# Altium schematic sheet Sheet1-nano.SchDoc
size A4
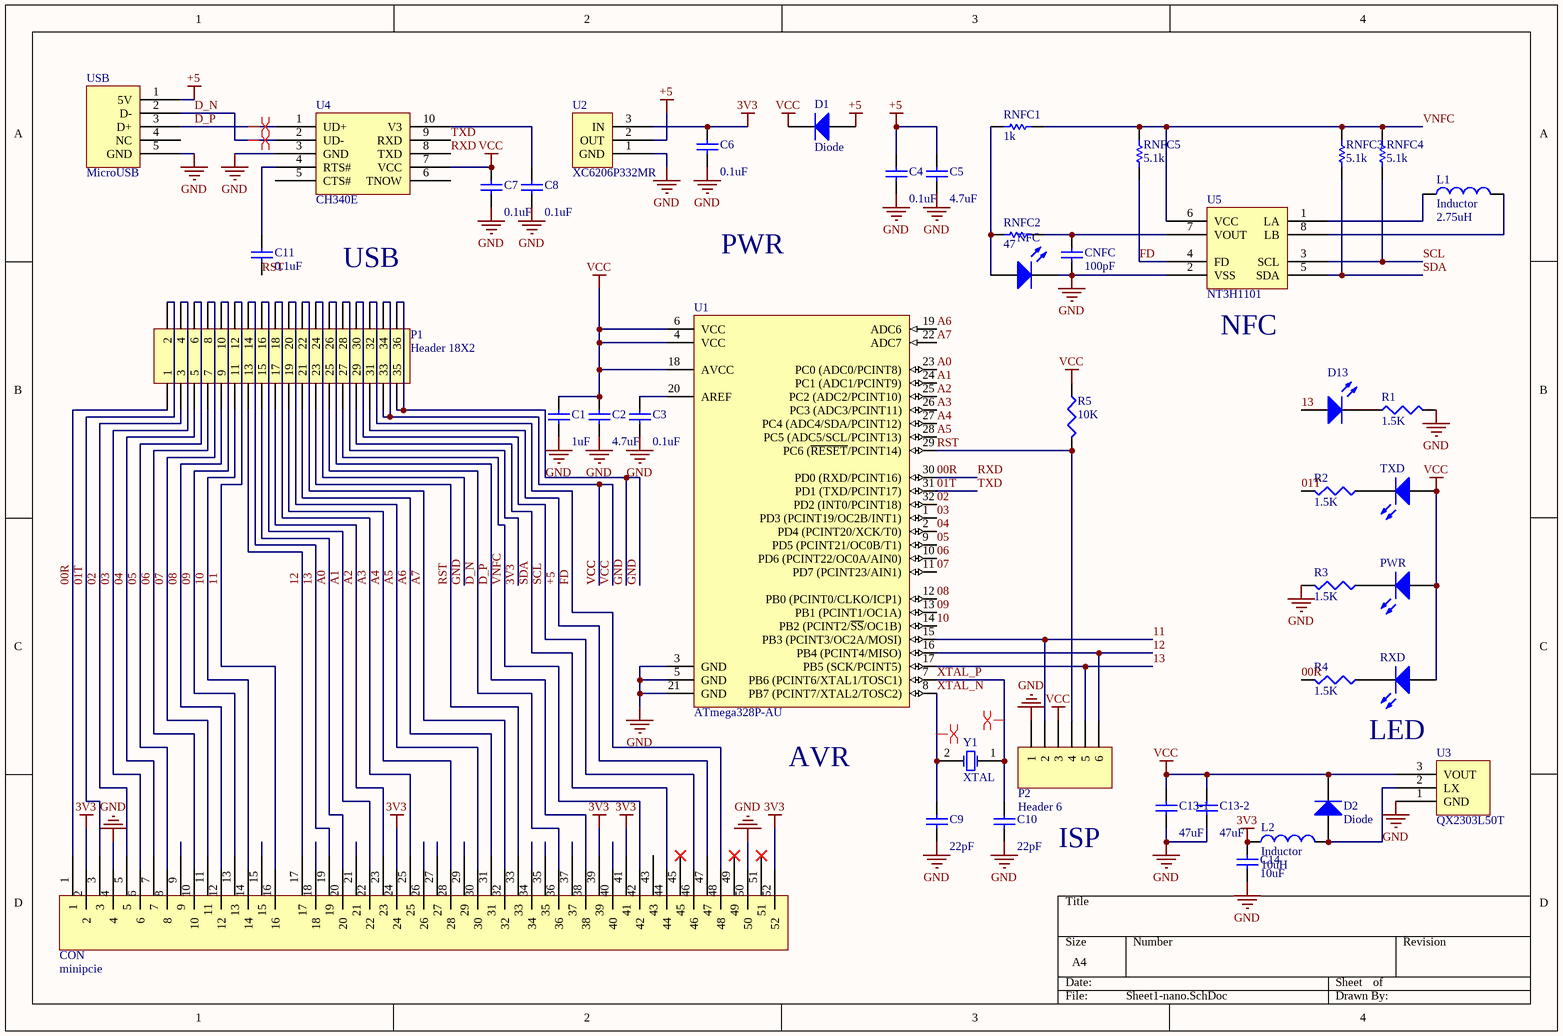
[diagram p0: Sheet1-nano.SchDoc]

## Parts
C1  value 1uF  [0603C]  (hidden comment: Cap)
C2  value 4.7uF  [0603C]  (hidden comment: Cap)
C3  value 0.1uF  [0603C]  (hidden comment: Cap)
C4  value 0.1uF  [0603C]  (hidden comment: Cap)
C5  value 4.7uF  [0603C]  (hidden comment: Cap)
C6  value 0.1uF  [0603C]  (hidden comment: Cap)
C7  value 0.1uF  [0603C]  (hidden comment: Cap)
C8  value 0.1uF  [0603C]  (hidden comment: Cap)
C9  value 22pF  [0603C]  (hidden comment: Cap)
C10  value 22pF  [0603C]  (hidden comment: Cap)
C11  value 0.1uF  [0603C]  (hidden comment: Cap)
C13-1  value 47uF  [0603C]  (hidden comment: Cap)
C13-2  value 47uF  [0603C]  (hidden comment: Cap)
C14  value 10uF  [0603C]  (hidden comment: Cap)
CNFC  value 100pF  [0603C]  (hidden comment: Cap)
CON  minipcie  [MINI PCI E PADS]
D1  Diode  [1206Led]
D2  Diode  [1206Led]
D13  LED0  [0805LED2]  (value not drawn)
L1  Inductor  value 2.75uH  [L-2.75uH]
L2  Inductor  value 10uH  [0603c]
NFC  LED1  [0805LED2]  (value not drawn)
P1  Header 18X2  [HDR2X18]
P2  Header 6  [HDR1X6]
PWR  LED0  [0805LED2]  (value not drawn)
R1  value 1.5K  [0805-1R]  (hidden comment: Res3)
R2  value 1.5K  [0805-1R]  (hidden comment: Res3)
R3  value 1.5K  [0805-1R]  (hidden comment: Res3)
R4  value 1.5K  [0805-1R]  (hidden comment: Res3)
R5  value 10K  [0805-1R]  (hidden comment: Res3)
RNFC1  value 1k  [0805-1R]  (hidden comment: Res1)
RNFC2  value 47  [0805-1R]  (hidden comment: Res1)
RNFC3  value 5.1k  [0805-1R]  (hidden comment: Res1)
RNFC4  value 5.1k  [0805-1R]  (hidden comment: Res1)
RNFC5  value 5.1k  [0805-1R]  (hidden comment: Res1)
RXD  LED0  [0805LED2]  (value not drawn)
TXD  LED0  [0805LED2]  (value not drawn)
U1  ATmega328P-AU  [32A_N]
U2  XC6206P332MR  [SOT-23]
U3  QX2303L50T  [sot23]
U4  CH340E  [MS10]
U5  NT3H1101  [XQFN-8_L1.6-W1.6-P0.50-BL]
USB  MicroUSB  [MicroUSB-InBoard]
Y1  XTAL  [SMD-3225]

## Nets
3V3: C6.2 C14.1 CON.2 CON.24 CON.39 CON.41 CON.52 L2.1 P1.28 U2.3(IN)
+5: C4.2 C5.2 CON.47 D1.1(A) P1.31 U2.2(OUT) USB.1(5V)
GND: C1.1 C2.1 C3.1 C4.1 C5.1 C6.1 C7.1 C8.1 C9.1 C10.1 C13-1.1 C13-2.1 C14.2 CNFC.1 CON.4 CON.50 NFC.2(K) P1.24 P1.35 P1.36 P2.1 R1.2 R3.2 U1.3(GND) U1.5(GND) U1.21(GND) U2.1(GND) U3.1(GND) U4.3(GND) U5.2(VSS) USB.5(GND)
VCC: C1.2 C2.2 C7.2 C13-1.2 C13-2.2 D1.2(K) D2.2(K) P1.33 P1.34 P2.3 PWR.1(A) R5.1 RXD.1(A) TXD.1(A) U1.4(VCC) U1.6(VCC) U1.18(AVCC) U3.3(VOUT) U4.7(VCC)
00R: CON.1 P1.1 R4.2 U1.30(PD0_(RXD/PCINT16)) U4.8(TXD)  [also labelled RXD]
01T: CON.3 P1.2 R2.2 U1.31(PD1_(TXD/PCINT17)) U4.9(RXD)  [also labelled TXD]
02: CON.5 P1.3 U1.32(PD2_(INT0/PCINT18))
03: CON.6 P1.4 U1.1(PD3_(PCINT19/OC2B/INT1))
04: CON.7 P1.5 U1.2(PD4_(PCINT20/XCK/T0))
05: CON.8 P1.6 U1.9(PD5_(PCINT21/OC0B/T1))
06: CON.10 P1.7 U1.10(PD6_(PCINT22/OC0A/AIN0))
07: CON.11 P1.8 U1.11(PD7_(PCINT23/AIN1))
08: CON.12 P1.9 U1.12(PB0_(PCINT0/CLKO/ICP1))
09: CON.13 P1.10 U1.13(PB1_(PCINT1/OC1A))
10: CON.14 P1.11 U1.14(PB2_(PCINT2/~{SS}/OC1B))
11: CON.16 P1.12 P2.2 U1.15(PB3_(PCINT3/OC2A/MOSI))
12: CON.17 P1.13 P2.6 U1.16(PB4_(PCINT4/MISO))
13: CON.19 D13.1(A) P1.14 P2.5 U1.17(PB5_(SCK/PCINT5))
A0: CON.20 P1.15 U1.23(PC0_(ADC0/PCINT8))
A1: CON.22 P1.16 U1.24(PC1_(ADC1/PCINT9))
A2: CON.23 P1.17 U1.25(PC2_(ADC2/PCINT10))
A3: CON.25 P1.18 U1.26(PC3_(ADC3/PCINT11))
A4: CON.28 P1.19 U1.27(PC4_(ADC4/SDA/PCINT12))
A5: CON.30 P1.20 U1.28(PC5_(ADC5/SCL/PCINT13))
A6: CON.31 P1.21 U1.19(ADC6)
A7: CON.32 P1.22 U1.22(ADC7)
D_N: CON.36 P1.25 U4.2(UD-) USB.2(D-)
D_P: CON.38 P1.26 U4.1(UD+) USB.3(D+)
FD: CON.48 P1.32 RNFC5.1 U5.4(FD)
RST: C11.1 CON.33 P1.23 P2.4 R5.2 U1.29(PC6_(~{RESET}/PCINT14))
SCL: CON.46 P1.30 RNFC4.1 U5.3(SCL)
SDA: CON.44 P1.29 RNFC3.1 U5.5(SDA)
VNFC: CON.42 P1.27 RNFC1.2 RNFC3.2 RNFC4.2 RNFC5.2 U5.6(VCC)
XTAL_N: C9.2 U1.8(PB7_(PCINT7/XTAL2/TOSC2)) Y1.2(OSC2)
XTAL_P: C10.2 U1.7(PB6_(PCINT6/XTAL1/TOSC1)) Y1.1(OSC1)
NetC3_2: C3.2 U1.20(AREF)
NetC8_2: C8.2 U4.10(V3)
NetC11_2: C11.2 U4.4(RTS#)
NetCNFC_2: CNFC.2 RNFC2.2 U5.7(VOUT)
NetD2_1: D2.1(A) L2.2 U3.2(LX)
NetD13_2: D13.2(K) R1.1
NetL1_1: L1.1 U5.1(LA)
NetL1_2: L1.2 U5.8(LB)
NetNFC_1: NFC.1(A) RNFC1.1 RNFC2.1
NetPWR_2: PWR.2(K) R3.1
NetR2_1: R2.1 TXD.2(K)
NetR4_1: R4.1 RXD.2(K)

Not connected (* = marked no-connect by the designer): CON 9 15 18 21 26 27 29 34 35 37 40 43 45* 49* 51*; U4 5(CTS#) 6(TNOW); USB 4(NC)

## Layout directives
differential pair: D_N, D_P, XTAL_N, XTAL_P

## Notes on the sheet
- USB
- PWR
- (near U5) NFC
- (near U1) AVR
- LED
- ISP

## Library data of the parts
C1-C11 C13-1 C13-2 C14 CNFC = Cap: Capacitor; Published: 8-Jun-2000; LatestRevisionDate: 17-Jul-2002; LatestRevisionNote: Re-released for DXP Platform.; PackageReference: RAD-0.3; Publisher: Altium Limited; PackageDescription: Radial Cap, Thru-Hole; 2 Leads; 0.3 in Pin Spacing
D1 D2 = Diode: Default Diode; Published: 8-Jun-2000; LatestRevisionDate: 17-Jul-2002; LatestRevisionNote: Re-released for DXP Platform.; PackageVersion: Sep-1996; PackageReference: SMC; Publisher: Altium Limited; PackageDescription: DO-214-AB/SMC; 2 C-Bend Leads; Body 7.9 x 5.9 mm, inc. leads (LxW); Code_JEDEC: DO-214-AB
D13 PWR RXD TXD = LED0: Typical INFRARED GaAs LED; Published: 8-Jun-2000; LatestRevisionDate: 08-Jul-2005; LatestRevisionNote: Mech Layer 1 removed.; PackageReference: LED-0; Publisher: Altium Limited; PackageDescription: LED; 2 Leads
L1 L2 = Inductor: Code_IEC: 1005; Published: 8-Jun-2000; LatestRevisionDate: 29-May-2009; LatestRevisionNote: IPC-7351 Footprint Added.; PackageReference: 0402-A; Publisher: Altium Limited; PackageDescription: Chip Inductor; Code_JEITA: 0402
NFC = LED1: Typical RED GaAs LED; Published: 8-Jun-2000; LatestRevisionDate: 08-Jul-2005; LatestRevisionNote: Mech Layer 1 removed.; PackageReference: LED-1; Publisher: Altium Limited; PackageDescription: LED; 2 Leads
P1 = Header 18X2: Header, 18-Pin, Dual row; LatestRevisionDate: 17-Jul-2002; LatestRevisionNote: Re-released for DXP Platform.; Publisher: Altium Limited
P2 = Header 6: Header, 6-Pin; LatestRevisionDate: 17-Jul-2002; LatestRevisionNote: Re-released for DXP Platform.; Publisher: Altium Limited
R1-R5 = Res3: Resistor; Published: 8-Jun-2000; LatestRevisionDate: 29-May-2009; LatestRevisionNote: IPC-7351 Footprint Added.; PackageReference: J1-0603; Publisher: Altium Limited; PackageDescription: Chip Resistor
RNFC1-RNFC5 = Res1: Resistor; Published: 8-Jun-2000; LatestRevisionDate: 17-Jul-2002; LatestRevisionNote: Re-released for DXP Platform.; PackageReference: AXIAL-0.3; Publisher: Altium Limited; PackageDescription: Axial Device, Thru-Hole; 2 Leads; 0.3 in Pin Spacing
U1 = ATmega328P-AU: 8-bit AVR Microcontroller, 32KB Flash, 1KB EEPROM, 2KB SRAM, 32-pin TQFP, Industrial Grade (-40癈 to 85癈); Published: 1-Apr-2010; DatasheetVersion: revA, Jan-2010; PackageVersion: revB, Oct-2001; PackageReference: 32A; Publisher: Altium Limited; PackageDescription: 32-Lead, 7x7x1.0 mm Body, 0.8mm Lead Pitch, Thin Profile Plastic Quad Flat Package (TQFP); Supplier 1: Digi-Key; Supplier Part Number 1: ATMEGA328P-AU-ND; Supplier 2: Farnell; Supplier Part Number 2: 1715486; Supplier 3: Mouser; Supplier Part Number 3: 556-ATMEGA328P-AU; Code_JEDEC: MS-026-ABA; ComponentLink1Description: Manufacturer Link; ComponentLink1URL: http://www.atmel.com/products/avr/default.asp?; ComponentLink2Description: ATmega48A/48PA/88A/88PA/168A/168PA/328/328P Datasheet; ComponentLink2URL: http://www.atmel.com/dyn/resources/prod_documents/8271.pdf; ComponentLink3Description: ATmega48A/48PA/88A/88PA/168A/168PA/328/328P Summary; ComponentLink3URL: http://www.atmel.com/dyn/resources/prod_documents/8271S.pdf; ComponentLink4Description: Atmel.com Home; ComponentLink4URL: http://www.atmel.com
U2 = AMS1117: pin to pad: 2>3 3>2
U3 = QX2303L50T: pin to pad: 2>3 3>2
Y1 = XTAL: Crystal Oscillator; Published: 8-Jun-2000; LatestRevisionDate: 17-Jul-2002; LatestRevisionNote: Re-released for DXP Platform.; PackageReference: R38; Publisher: Altium Limited; PackageDescription: Crystal, Thru-Hole; 2 Leads; Body 3.1 x 8.2 mm (Dia.xH)